# Altium schematic sheet Power_Regulation.SchDoc
size A
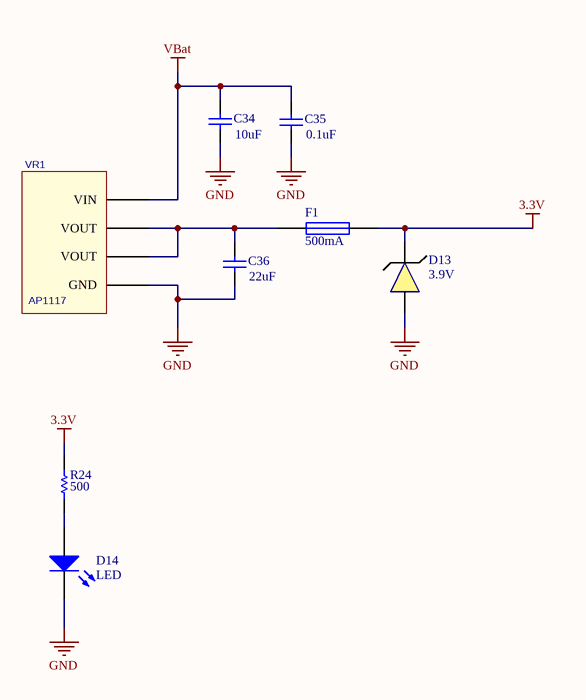
[diagram p0: Power_Regulation.SchDoc]

## Parts
C34  value 10uF  [1608[0603]]  (hidden comment: Cap Semi)
C35  value 0.1uF  [1608[0603]]  (hidden comment: Cap Semi)
C36  value 22uF  [1608[0603]]  (hidden comment: Cap Semi)
D13  3.9V  [DO-214AC]
D14  LED  [0603]
F1  500mA  [0603 PTC Fuse]
R24  value 500  [0603]  (hidden comment: Resistor)
VR1  AP1117  [SOT-223]

## Nets
3.3V: D13.1 F1.2 R24.2
GND: C34.1 C35.1 C36.1 D13.2 D14.2(K) VR1.1(GND)
VBat: C34.2 C35.2 VR1.3(VIN)
NetC36_2: C36.2 F1.1 VR1.2(VOUT) VR1.4(VOUT)
NetD14_1: D14.1(A) R24.1

## Library data of the parts
C34-C36 = Cap Semi: Capacitor (Semiconductor SIM Model); Published: 8-Jun-2000; LatestRevisionDate: 29-May-2009; LatestRevisionNote: IPC-7351 Footprint Added.; PackageReference: C1206; Publisher: Altium Limited; PackageDescription: Chip Capacitor
D13 = Zener Diode: 3.9V 1.25W
D14 = LED: Vendor Part Number: 751-1203-ND; Manufacturer: Vishay; Manufacturer Part Number: TSAL6100; Vendor: Digikey; Published: 16-Mar-2013; LatestRevisionDate: 16-Mar-2013; LatestRevisionNote: Created; PackageReference: LED; Publisher: Anthony Merlino; PackageDescription: 5mm LED; 2 Leads
F1 = Fuse: Published: 8-Jun-2000; LatestRevisionDate: 17-Jul-2002; LatestRevisionNote: Re-released for DXP Platform.; PackageReference: PIN-W2/E2.8; Publisher: Altium Limited; PackageDescription: Thru-Hole; 2 Leads
R24 = Resistor: Published: 8-Jun-2000; LatestRevisionDate: 17-Jul-2002; LatestRevisionNote: Re-released for DXP Platform.; PackageReference: AXIAL-0.3; Publisher: Altium Limited
VR1 = AP1117: Value: *